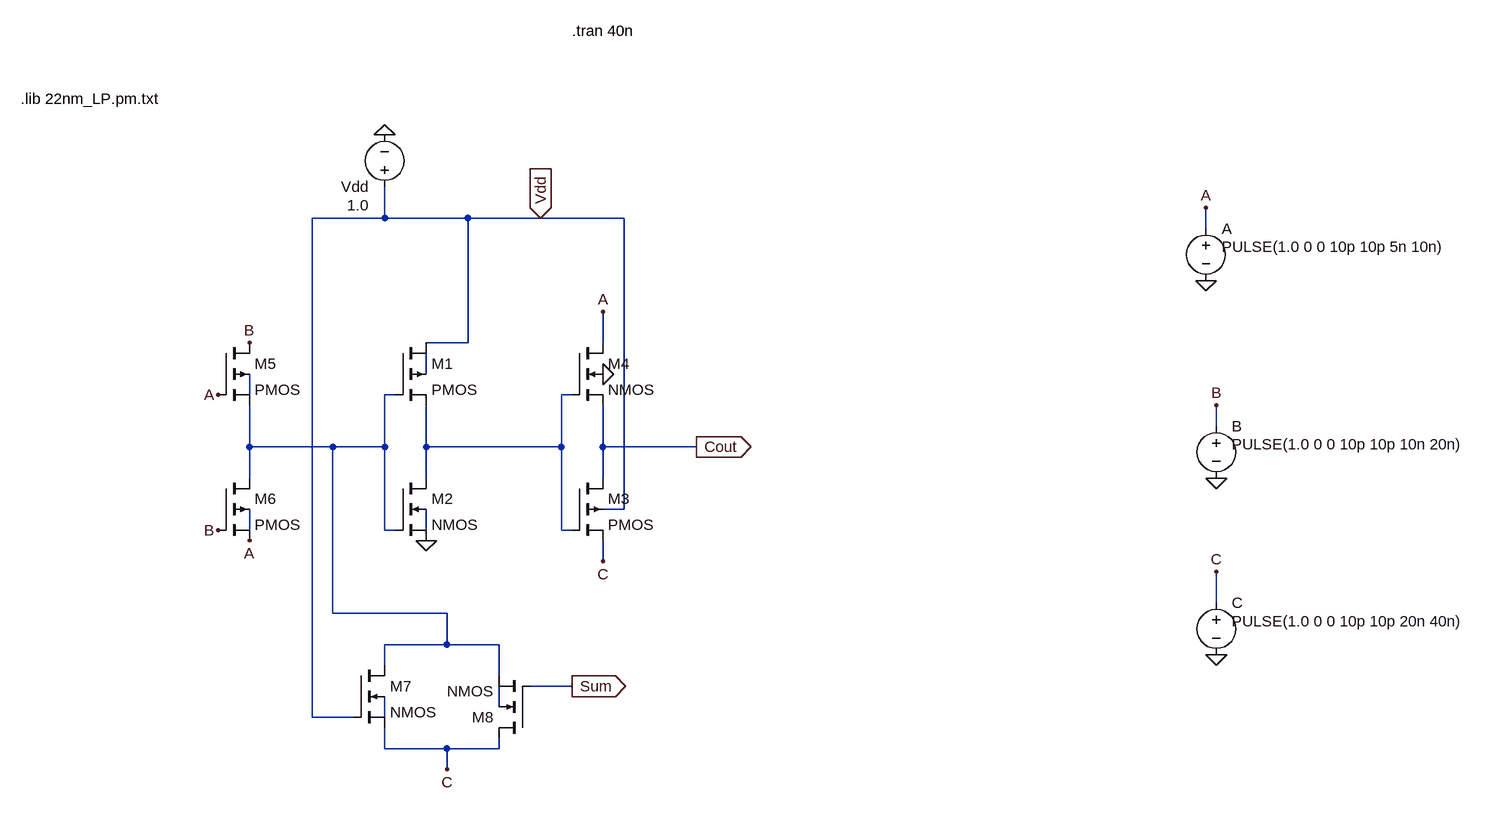
[diagram p0: schematic InXA2_45nm.asc]
InXA2_45nm.asc, the LTspice schematic file:
Version 4
SHEET 1 1044 692
WIRE -640 -240 -640 -288
WIRE -640 -240 -752 -240
WIRE -512 -240 -640 -240
WIRE -400 -240 -512 -240
WIRE -272 -240 -400 -240
WIRE 624 -224 624 -256
WIRE -512 -48 -512 -240
WIRE -512 -48 -576 -48
WIRE -304 -48 -304 -96
WIRE -576 0 -576 -32
WIRE -848 32 -848 0
WIRE -624 32 -640 32
WIRE -352 32 -368 32
WIRE 640 80 640 48
WIRE -848 112 -848 48
WIRE -720 112 -848 112
WIRE -640 112 -640 32
WIRE -640 112 -720 112
WIRE -576 112 -576 48
WIRE -368 112 -368 32
WIRE -368 112 -576 112
WIRE -304 112 -304 48
WIRE -160 112 -304 112
WIRE -848 160 -848 112
WIRE -576 160 -576 112
WIRE -304 160 -304 112
WIRE -272 208 -272 -240
WIRE -272 208 -304 208
WIRE -848 240 -848 208
WIRE -640 240 -640 112
WIRE -624 240 -640 240
WIRE -576 240 -576 208
WIRE -368 240 -368 112
WIRE -352 240 -368 240
WIRE -304 288 -304 256
WIRE 640 352 640 304
WIRE -720 368 -720 112
WIRE -544 368 -720 368
WIRE -544 416 -544 368
WIRE -544 416 -640 416
WIRE -464 416 -544 416
WIRE -640 448 -640 416
WIRE -464 464 -464 416
WIRE -352 480 -416 480
WIRE -464 512 -464 480
WIRE -752 528 -752 -240
WIRE -688 528 -752 528
WIRE -640 528 -640 496
WIRE -640 576 -640 544
WIRE -544 576 -640 576
WIRE -464 576 -464 560
WIRE -464 576 -544 576
WIRE -544 608 -544 576
FLAG 624 -144 0
FLAG 640 160 0
FLAG 640 432 0
FLAG 624 -256 A
FLAG 640 48 B
FLAG 640 304 C
FLAG -400 -240 Vdd
IOPIN -400 -240 In
FLAG -640 -368 0
FLAG -896 32 A
FLAG -848 256 A
FLAG -896 240 B
FLAG -848 -48 B
FLAG -576 256 0
FLAG -304 0 0
FLAG -304 -96 A
FLAG -304 288 C
FLAG -160 112 Cout
IOPIN -160 112 Out
FLAG -544 608 C
FLAG -352 480 Sum
IOPIN -352 480 Out
SYMBOL voltage 624 -240 R0
WINDOW 3 24 44 Left 2
WINDOW 123 0 0 Left 0
WINDOW 39 0 0 Left 0
SYMATTR Value PULSE(1.0 0 0 10p 10p 5n 10n)
SYMATTR InstName A
SYMBOL voltage 640 64 R0
WINDOW 3 24 44 Left 2
WINDOW 123 0 0 Left 0
WINDOW 39 0 0 Left 0
SYMATTR Value PULSE(1.0 0 0 10p 10p 10n 20n)
SYMATTR InstName B
SYMBOL voltage 640 336 R0
WINDOW 3 24 44 Left 2
WINDOW 123 0 0 Left 0
WINDOW 39 0 0 Left 0
SYMATTR Value PULSE(1.0 0 0 10p 10p 20n 40n)
SYMATTR InstName C
SYMBOL voltage -640 -272 R180
WINDOW 3 24 -12 Left 2
WINDOW 123 0 0 Left 0
WINDOW 39 0 0 Left 0
SYMATTR Value 1.0
SYMATTR InstName Vdd
SYMBOL pmos4 -624 -48 R0
SYMATTR InstName M1
SYMATTR Value2 l=45n w=2u
SYMBOL nmos4 -624 160 R0
SYMATTR InstName M2
SYMATTR Value2 l=45n w=1u
SYMBOL nmos4 -352 -48 R0
SYMATTR InstName M4
SYMATTR Value2 l=45n w=1u
SYMBOL pmos4 -352 160 R0
SYMATTR InstName M3
SYMATTR Value2 l=45n w=2u
SYMBOL pmos4 -896 -48 R0
SYMATTR InstName M5
SYMATTR Value2 l=45n w=2u
SYMBOL pmos4 -896 160 R0
SYMATTR InstName M6
SYMATTR Value2 l=45n w=2u
SYMBOL nmos4 -688 448 R0
SYMATTR InstName M7
SYMATTR Value2 l=45n w=1u
SYMBOL nmos4 -416 560 R180
SYMATTR InstName M8
SYMATTR Value2 l=45n w=1u
TEXT -1200 -424 Left 2 !.lib 22nm_LP.pm.txt
TEXT -352 -528 Left 2 !.tran 40n

The netlist it stands for:
* InXA2_45nm.asc
V§A A 0 PULSE(1.0 0 0 10p 10p 5n 10n)
V§B B 0 PULSE(1.0 0 0 10p 10p 10n 20n)
V§C C 0 PULSE(1.0 0 0 10p 10p 20n 40n)
Vdd Vdd 0 1.0
M1 Vdd N003 N004 N001 PMOS l=45n w=2u
M2 N004 N003 0 N006 NMOS l=45n w=1u
M4 A N004 Cout 0 NMOS l=45n w=1u
M3 Cout N004 C Vdd PMOS l=45n w=2u
M5 B A N003 N002 PMOS l=45n w=2u
M6 N003 B A N005 PMOS l=45n w=2u
M7 N003 Vdd C N008 NMOS l=45n w=1u
M8 C Sum N003 N007 NMOS l=45n w=1u
.model NMOS NMOS
.model PMOS PMOS
.lib standard.mos
.lib 22nm_LP.pm.txt
.tran 40n
.backanno
.end

* Results of the author's LTspice run, read from the files saved beside the schematic
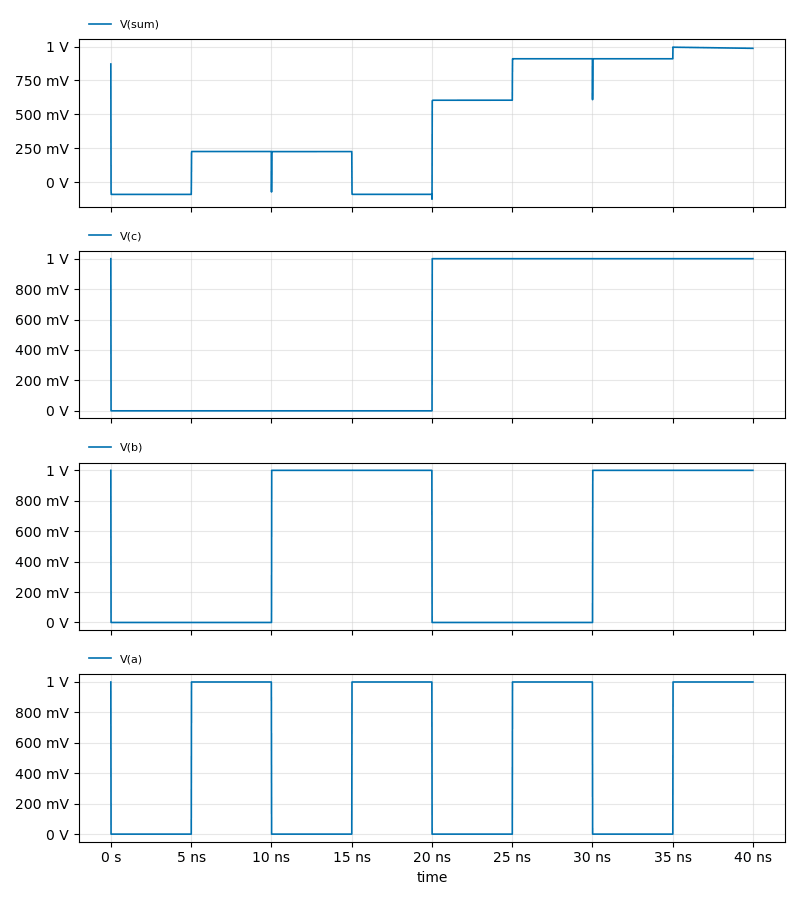
[diagram p1: Transient Analysis of InXA2_45nm.asc, plotted from the saved traces]
* Transient Analysis, 1 run:
*   V(sum): min -125.7 mV, max 996.3 mV, average 460.1 mV, rms 624.1 mV, last 986.9 mV
*   V(c): min 0 V, max 1 V, average 499.7 mV, rms 706.9 mV, last 1 V
*   V(b): min 0 V, max 1 V, average 499.5 mV, rms 706.6 mV, last 1 V
*   V(a): min 0 V, max 1 V, average 499 mV, rms 706.2 mV, last 1 V